# EAGLE design morse_lora_v6 (EAGLE 9.6.2)
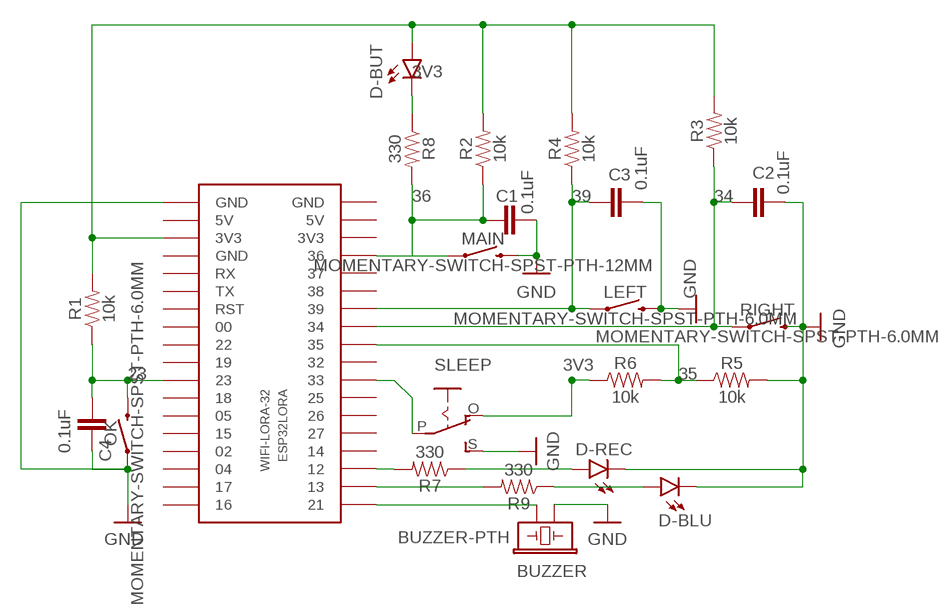
[diagram p0: schematic, sheet 1]

## Parts
BUZZER  BUZZER-PTH  [BUZZER-12MM]
C1  0.1uF  0.1UF-KIT-EZ-50V-20%  [CAP-PTH-SMALL-KIT]
C2  0.1uF  0.1UF-KIT-EZ-50V-20%  [CAP-PTH-SMALL-KIT]
C3  0.1uF  0.1UF-KIT-EZ-50V-20%  [CAP-PTH-SMALL-KIT]
C4  0.1uF  0.1UF-KIT-EZ-50V-20%  [CAP-PTH-SMALL-KIT]
D-BLU  LED5MM  [LED_5MM]
D-BUT  LED5MM  [LED_5MM]
D-REC  LED5MM  [LED_5MM]
ESP32LORA  WIFI-LORA-32  [2.54MM_2X18]
LEFT  MOMENTARY-SWITCH-SPST-PTH-6.0MM  [TACTILE_SWITCH_PTH_6.0MM]
MAIN  MOMENTARY-SWITCH-SPST-PTH-12MM  [TACTILE_SWITCH_PTH_12MM]
OK  MOMENTARY-SWITCH-SPST-PTH-6.0MM  [TACTILE_SWITCH_PTH_6.0MM]
R1  10k  10KOHM-HORIZ_KIT-1/4W-1%  [AXIAL-0.3-KIT]
R2  10k  10KOHM-HORIZ_KIT-1/4W-1%  [AXIAL-0.3-KIT]
R3  10k  10KOHM-HORIZ_KIT-1/4W-1%  [AXIAL-0.3-KIT]
R4  10k  10KOHM-HORIZ_KIT-1/4W-1%  [AXIAL-0.3-KIT]
R5  10k  10KOHM-HORIZ_KIT-1/4W-1%  [AXIAL-0.3-KIT]
R6  10k  10KOHM-HORIZ_KIT-1/4W-1%  [AXIAL-0.3-KIT]
R7  330  330OHM-HORIZ-1/10W-5%  [AXIAL-0.3]
R8  330  330OHM-HORIZ-1/10W-5%  [AXIAL-0.3]
R9  330  330OHM-HORIZ-1/10W-5%  [AXIAL-0.3]
RIGHT  MOMENTARY-SWITCH-SPST-PTH-6.0MM  [TACTILE_SWITCH_PTH_6.0MM]
SLEEP  EG1218S  [EG1218]

## Nets
3V3: D-BUT.A ESP32LORA.P$3(3V3) R1.P$2 R2.P$2 R3.P$2 R4.P$2 R6.P$1 SLEEP.O
23: C4.2 ESP32LORA.P$11 OK.3 R1.P$1
34: C2.2 ESP32LORA.P$29 R3.P$1 RIGHT.1
35: ESP32LORA.P$28 R5.P$1 R6.P$2
36: C1.2 ESP32LORA.P$33 MAIN.1 R2.P$1 R8.P$2
39: C3.1 ESP32LORA.P$30 LEFT.1 R4.P$1
GND: BUZZER.- C1.1 C2.1 C3.2 C4.1 D-BLU.K(C) D-REC.K(C) ESP32LORA.P$1(GND) LEFT.3 MAIN.3 OK.1 R5.P$2 RIGHT.3 SLEEP.S
N$1: ESP32LORA.P$21 R7.P$2
N$2: D-BUT.K(C) R8.P$1
N$3: D-BLU.A R9.P$1
N$4: BUZZER.+ ESP32LORA.P$19
N$5: D-REC.A R7.P$1
N$6: ESP32LORA.P$20 R9.P$2
N$13: ESP32LORA.P$26 SLEEP.P
Unconnected: ESP32LORA.P$2(5V) ESP32LORA.P$4(GND) ESP32LORA.P$5(RX) ESP32LORA.P$6(TX) ESP32LORA.P$7(RST) ESP32LORA.P$8 ESP32LORA.P$9 ESP32LORA.P$10 ESP32LORA.P$12 ESP32LORA.P$13 ESP32LORA.P$14 ESP32LORA.P$15 ESP32LORA.P$16 ESP32LORA.P$17 ESP32LORA.P$18 ESP32LORA.P$22 ESP32LORA.P$23 ESP32LORA.P$24 ESP32LORA.P$25 ESP32LORA.P$27 ESP32LORA.P$31 ESP32LORA.P$32 ESP32LORA.P$34(3V3) ESP32LORA.P$35(5V) ESP32LORA.P$36(GND)

## Library data of the parts
BUZZER = SparkFun-Electromechanical:BUZZER: Buzzer Small round buzzers that operate around the audible 2kHz range. You can use these as speakers to create simple music or user interfaces. Variant Overview: PTH - Mini Speaker - PC Mount 12mm 2.048kHz <https://www.sparkfun.com/products/7950> PTH_KIT - Mini Speaker - PC Mount 12mm 2.048kHz <https://www.sparkfun.com/products/7950> KIT simplifies soldering by adding stop mask to one side of the pads. PTH_NO_SILK - Mini Speaker - PC Mount 12mm 2.048kHz <https://www.sparkfun.com/products/7950> No silkscreen indicator of buzzer outline. PTH_KIT_NO_SILK - Mini Speaker - PC Mount 12mm 2.048kHz <https://www.sparkfun.com/products/7950> KIT package w/o silkscreen SMD - Buzzer Audio Magnetic (CCV-084B16) SMD buzzer used on, e.g. the LilyPad Buzzer <https://www.sparkfun.com/products/8463> and RFID USB Reader <https://www.sparkfun.com/products/9963>. SMD_KIT - Buzzer Audio Magnetic (CCV-084B16) SMD Buzzer with elongated pins to make soldering easier. Used on the SparkFun Simon Says - Surface Mount Soldering Kit <https://www.sparkfun.com/products/10935>.; PROD_ID: COMP-08253; SF_SKU: COM-07950
C1-C4 = SparkFun-Capacitors:0.1UF: 0.1µF ceramic capacitors A capacitor is a passive two-terminal electrical component used to store electrical energy temporarily in an electric field.; PROD_ID: CAP-08370
D-BLU D-BUT D-REC = SparkFun-LED:LED: LED (Generic) Standard schematic elements and footprints for 5mm, 3mm, 1206, and 0603 sized LEDs. Generic LEDs with no color specified.
ESP32LORA = ESP32_modules:WIFI-LORA-32
LEFT OK RIGHT = SparkFun-Switches:MOMENTARY-SWITCH-SPST: Momentary Switch (Pushbutton) - SPST Normally-open (NO) SPST momentary switches (buttons, pushbuttons). Variants PTH-12MM - 12mm square, through-hole Momentary Pushbutton Switch - 12mm Square <https://www.sparkfun.com/products/9190> (COM-09190) PTH-6.0MM, PTH-6.0MM-KIT - 6.0mm square, through-hole Mini Pushbutton Switch <https://www.sparkfun.com/products/97> (COM-00097) KIT package intended for soldering kit's - only one side of pads' copper is exposed. PTH-RIGHT-ANGLE-KIT - Right-angle, through-hole Right Angle Tactile Button <https://www.sparkfun.com/products/10791> - Used on SparkFun BigTime Watch Kit <https://www.sparkfun.com/products/11734> SMD-12MM - 12mm square, surface-mount Tactile Button - SMD (12mm) <https://www.sparkfun.com/products/12993> (COM-12993) Used on SparkFun PicoBoard <https://www.sparkfun.com/products/11888> SMD-4.5MM - 4.5mm Square Trackball Switch Used on SparkFun Blackberry Trackballer Breakout <https://www.sparkfun.com/products/13169> SMD-4.6MMX2.8MM - 4.60mm x 2.80mm, surface mount Used on SparkFun SAMD21 Mini Breakout <https://www.sparkfun.com/products/13664> SMD-5.2MM, SMD-5.2-REDUNDANT - 5.2mm square, surface-mount Mini Pushbutton Switch - SMD <https://www.sparkfun.com/products/8720> (COM-08720) Used on Arduino Pro Mini <https://www.sparkfun.com/products/11114> REDUNDANT package connects both switch circuits together SMD-6.0X3.5MM - 6.0 x 3.5mm, surface mount Momentary Reset Switch SMD <https://www.sparkfun.com/products/8229> (COM-08229) SMD-6.2MM-TALL - 6.2mm square, surface mount Tactile Button - SMD (6mm) <https://www.sparkfun.com/products/12992> Used on SparkFun Digital Sandbox <https://www.sparkfun.com/products/12651> SMD-RIGHT-ANGLE - Right-angle, surface mount Used on SparkFun Block for Intel® Edison - Arduino <https://www.sparkfun.com/products/13036>; PROD_ID: SWCH-08441; SF_SKU: COM-00097
MAIN = SparkFun-Switches:MOMENTARY-SWITCH-SPST: Momentary Switch (Pushbutton) - SPST Normally-open (NO) SPST momentary switches (buttons, pushbuttons). Variants PTH-12MM - 12mm square, through-hole Momentary Pushbutton Switch - 12mm Square <https://www.sparkfun.com/products/9190> (COM-09190) PTH-6.0MM, PTH-6.0MM-KIT - 6.0mm square, through-hole Mini Pushbutton Switch <https://www.sparkfun.com/products/97> (COM-00097) KIT package intended for soldering kit's - only one side of pads' copper is exposed. PTH-RIGHT-ANGLE-KIT - Right-angle, through-hole Right Angle Tactile Button <https://www.sparkfun.com/products/10791> - Used on SparkFun BigTime Watch Kit <https://www.sparkfun.com/products/11734> SMD-12MM - 12mm square, surface-mount Tactile Button - SMD (12mm) <https://www.sparkfun.com/products/12993> (COM-12993) Used on SparkFun PicoBoard <https://www.sparkfun.com/products/11888> SMD-4.5MM - 4.5mm Square Trackball Switch Used on SparkFun Blackberry Trackballer Breakout <https://www.sparkfun.com/products/13169> SMD-4.6MMX2.8MM - 4.60mm x 2.80mm, surface mount Used on SparkFun SAMD21 Mini Breakout <https://www.sparkfun.com/products/13664> SMD-5.2MM, SMD-5.2-REDUNDANT - 5.2mm square, surface-mount Mini Pushbutton Switch - SMD <https://www.sparkfun.com/products/8720> (COM-08720) Used on Arduino Pro Mini <https://www.sparkfun.com/products/11114> REDUNDANT package connects both switch circuits together SMD-6.0X3.5MM - 6.0 x 3.5mm, surface mount Momentary Reset Switch SMD <https://www.sparkfun.com/products/8229> (COM-08229) SMD-6.2MM-TALL - 6.2mm square, surface mount Tactile Button - SMD (6mm) <https://www.sparkfun.com/products/12992> Used on SparkFun Digital Sandbox <https://www.sparkfun.com/products/12651> SMD-RIGHT-ANGLE - Right-angle, surface mount Used on SparkFun Block for Intel® Edison - Arduino <https://www.sparkfun.com/products/13036>; PROD_ID: SWCH-09185; SF_SKU: COM-09190
R1-R6 = SparkFun-Resistors:10KOHM: 10kΩ resistor A resistor is a passive two-terminal electrical component that implements electrical resistance as a circuit element. Resistors act to reduce current flow, and, at the same time, act to lower voltage levels within circuits. - Wikipedia; PROD_ID: RES-12183
R7-R9 = SparkFun-Resistors:330OHM: 330Ω resistor A resistor is a passive two-terminal electrical component that implements electrical resistance as a circuit element. Resistors act to reduce current flow, and, at the same time, act to lower voltage levels within circuits. - Wikipedia; PROD_ID: RES-8371
SLEEP = adafruit:EG1218: SLIDING SWITCH 0.1" spacing through hole, vertical SPDT slide switch http://www.ladyada.net/library/pcb/eaglelibrary.html

## Board
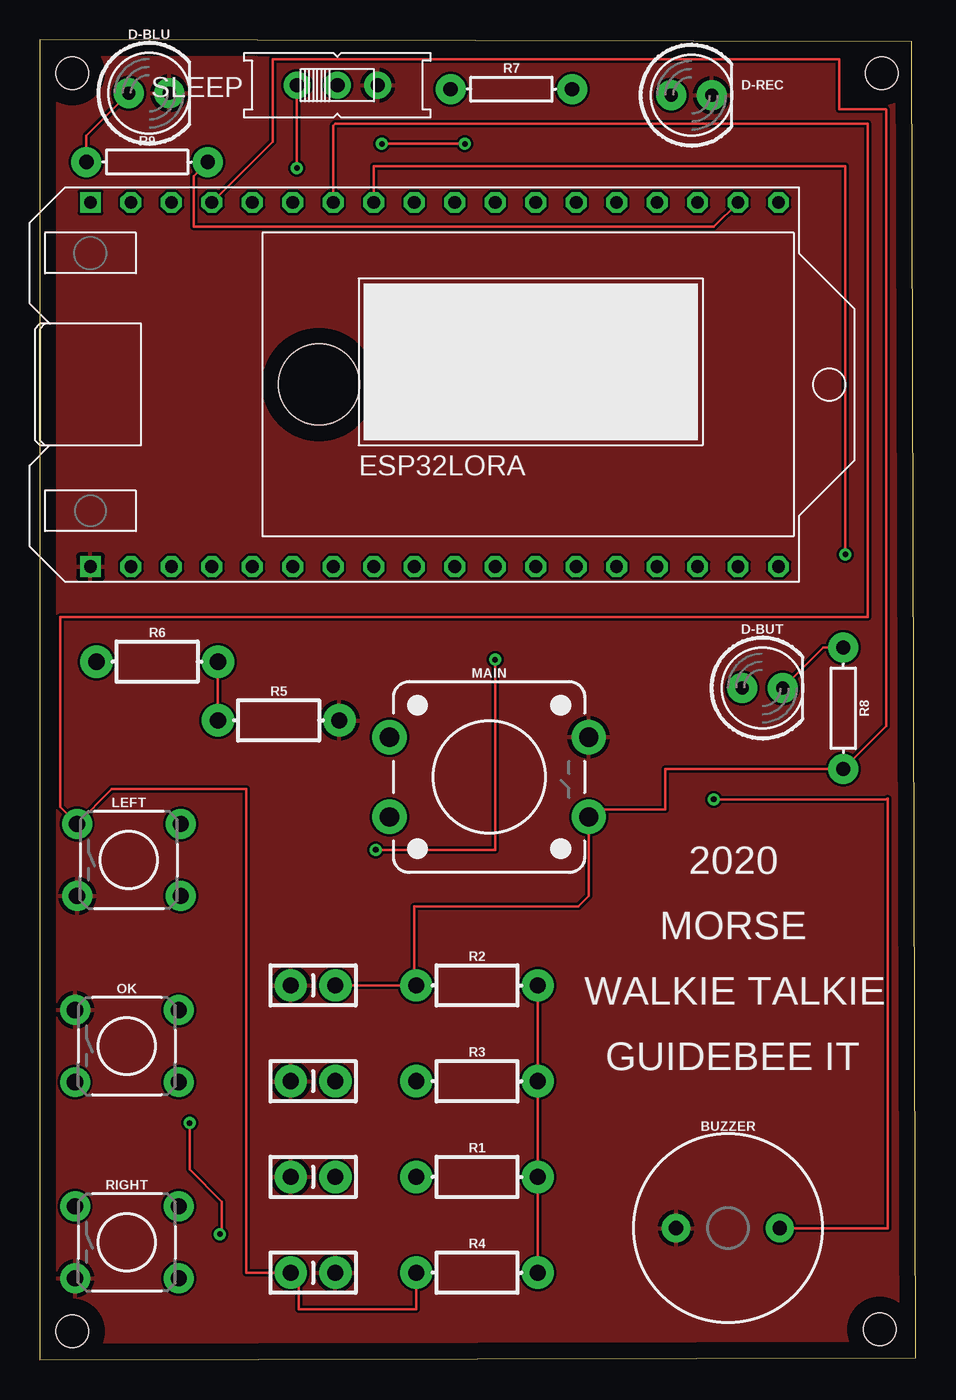
[diagram p1: board, top side]
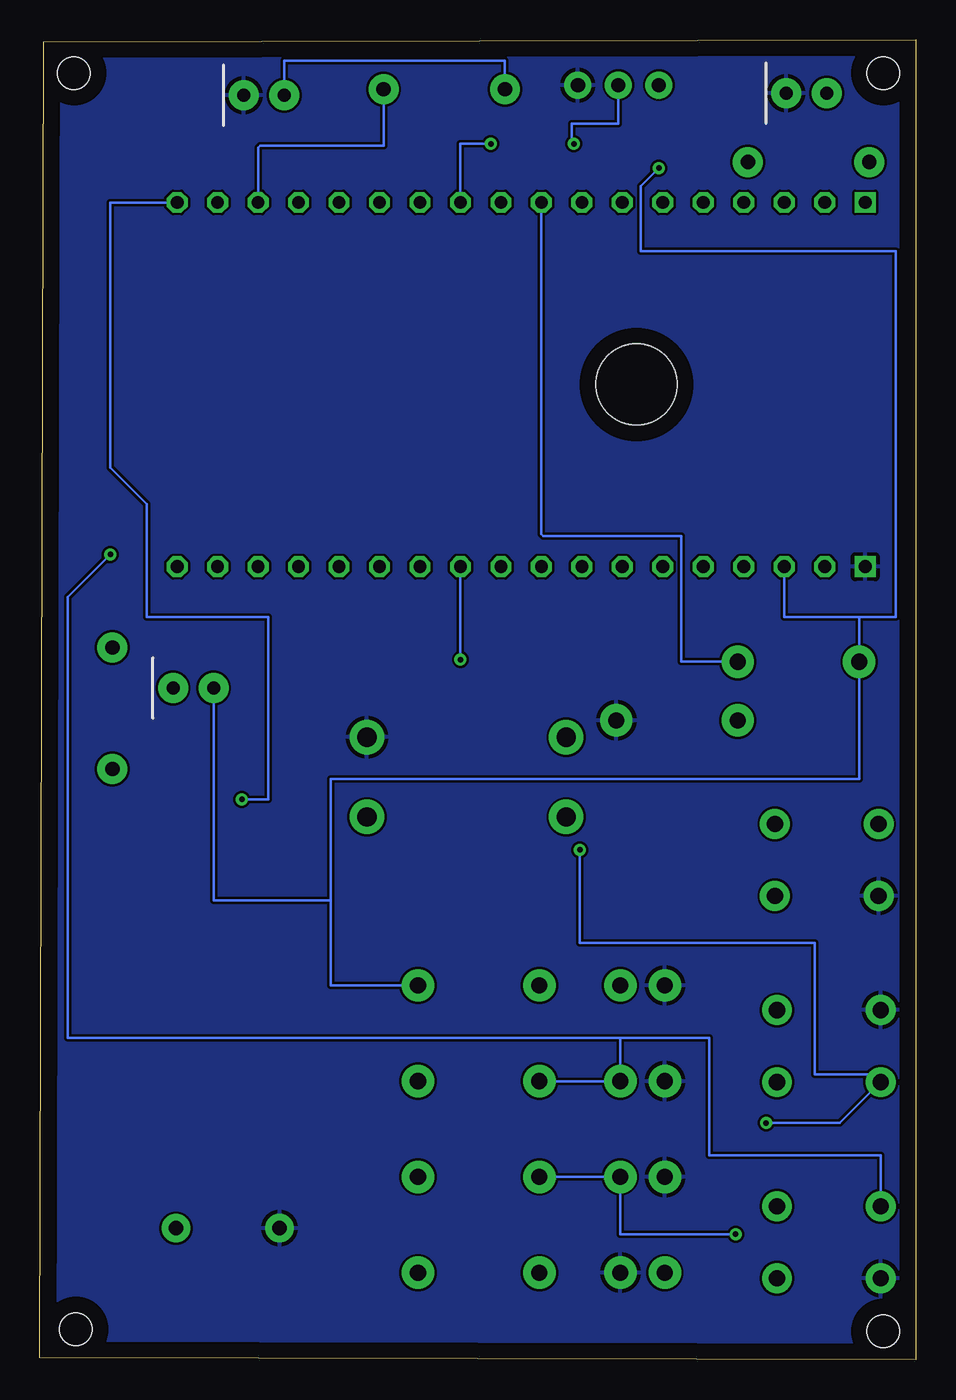
[diagram p2: board, bottom side, seen from below]

Size 54.97 x 82.85 mm. Coordinates in mm from the lower left corner, seen from the top.
Outline: 0,0 54.97,0.13 54.72,82.73 0,82.86 0,0
Copper layers (1*16): Top 0.035mm / dielectric 1.5mm / Bottom 0.035mm
Design rules "default": minimum track width 6mil, minimum drill 0.35mm, track to track 6mil, track to pad 6mil, pad to pad 6mil, via to via 6mil, smd to smd 6mil, copper to edge 40mil, drill to drill 6mil, minimum pad ring 10mil, minimum via ring 8mil, stop-mask expansion 4mil, vias tented up to drill 0mil, thermal gap 10mil
Holes 2.03 mm at 2.03,80.77 52.83,80.77 52.7,1.9 2.03,1.78
Holes 5.08 mm at 17.53,61.21

### Footprints (pad centres in the part's own frame; a part is rotated, then mirrored left to right if it is on the bottom)
BUZZER-12MM = drill 0.9 pad 1.778: + 3.25,0; - -3.25,0
CAP-PTH-SMALL-KIT = drill 1.016 pad 2.032: 1 -1.397,0; 2 1.397,0
LED_5MM = drill 0.813 pad 1.88: A -1.27,0; K 1.27,0
2.54MM_2X18 = drill 0.8 square: P$1 -20.32,-11.43; P$36 -20.32,11.43 | drill 0.8 octagon: P$2 -17.78,-11.43; P$3 -15.24,-11.43; P$4 -12.7,-11.43; P$5 -10.16,-11.43; P$6 -7.62,-11.43; P$7 -5.08,-11.43; P$8 -2.54,-11.43; P$9 0,-11.43; P$10 2.54,-11.43; P$11 5.08,-11.43; P$12 7.62,-11.43; P$13 10.16,-11.43; P$14 12.7,-11.43; P$15 15.24,-11.43; P$16 17.78,-11.43; P$17 20.32,-11.43; P$18 22.86,-11.43; P$19 22.86,11.43; P$20 20.32,11.43; P$21 17.78,11.43; P$22 15.24,11.43; P$23 12.7,11.43; P$24 10.16,11.43; P$25 7.62,11.43; P$26 5.08,11.43; P$27 2.54,11.43; P$28 0,11.43; P$29 -2.54,11.43; P$30 -5.08,11.43; P$31 -7.62,11.43; P$32 -10.16,11.43; P$33 -12.7,11.43; P$34 -15.24,11.43; P$35 -17.78,11.43
TACTILE_SWITCH_PTH_6.0MM = drill 1.016 pad 1.88: 1 -3.251,2.261; 2 3.251,2.261; 3 -3.251,-2.261; 4 3.251,-2.261
TACTILE_SWITCH_PTH_12MM = drill 1.2 pad 2.159: 1 6.25,-2.5; 2 -6.25,-2.5; 3 6.25,2.5; 4 -6.25,2.5
AXIAL-0.3-KIT = drill 1.016 pad 2.032: P$1 -3.81,0; P$2 3.81,0
AXIAL-0.3 = drill 0.9 pad 1.88: P$1 -3.81,0; P$2 3.81,0
EG1218 = drill 0.9 pad 1.676: O -2.54,0; P 0,0; S 2.54,0

### Placement (x,y rotation side)
BUZZER  43.18,8.25 0 top
C1  17.15,23.49 0 top
C2  17.15,17.48 0 top
C3  17.15,5.46 0 top
C4  17.15,11.47 0 top
D-BLU  6.86,79.5 0 top
D-BUT  45.34,42.16 0 top
D-REC  40.89,79.38 0 top
ESP32LORA  23.5,61.21 0 top
LEFT  5.59,31.37 0 top
MAIN  28.19,36.58 0 top
OK  5.46,19.68 0 top
R1  27.43,11.47 0 top
R2  27.43,23.49 0 top
R3  27.43,17.48 0 top
R4  27.43,5.46 0 top
R5  14.99,40.13 0 top
R6  7.37,43.81 0 top
R7  29.59,79.76 0 top
R8  50.42,40.89 270 top
R9  6.73,75.18 0 top
RIGHT  5.46,7.37 0 top
SLEEP  18.67,80.01 0 top

### Tracks (layer width: path | path; a pad name or v marks a point on that pad's centre or on a via)
3V3  (via drill 0.35)
  Top 0.152: SLEEP.O v16.13,74.8 | R2.P$2 R3.P$2 R1.P$2 R4.P$2
  Bottom 0.152: v16.13,74.8 17.27,73.66 17.27,69.6 1.27,69.6 1.27,46.61 3.56,46.61 | 3.56,46.61 8.26,46.61 ESP32LORA.P$3 | 36.7,28.83 36.7,36.45 3.56,36.45 R6.P$1 3.56,46.61 | R2.P$2 36.7,23.49 36.7,28.83 | D-BUT.A 44.07,28.83 36.7,28.83
23  (via drill 0.35)
  Top 0.152: v28.58,43.94 28.58,32 v21.08,32 | v9.4,14.86 9.4,11.94 11.43,9.91 11.43,8 v11.3,7.87
  Bottom 0.152: ESP32LORA.P$11 v28.58,43.94 | v21.08,32 21.08,26.16 6.35,26.16 6.35,17.91 2.69,17.91 OK.3 4.77,14.86 v9.4,14.86 | v11.3,7.87 18.54,7.87 C4.2 R1.P$1
34  (via drill 0.35)
  Top 0.152: ESP32LORA.P$29 20.96,74.93 50.55,74.93 v50.55,50.55
  Bottom 0.152: v50.55,50.55 53.21,47.88 53.21,20.19 18.54,20.19 | 18.54,20.19 C2.2 R3.P$1 | 18.54,20.19 12.95,20.19 12.95,12.83 2.21,12.83 RIGHT.1
35
  Top 0.152: R6.P$2 R5.P$1
  Bottom 0.152: ESP32LORA.P$28 23.5,51.82 23.37,51.69 14.73,51.69 14.73,43.81 R6.P$2
36
  Top 0.152: C1.2 R2.P$1 23.5,23.62 23.5,28.45 33.78,28.45 34.44,29.11 MAIN.1 34.91,34.54 39.24,34.54 39.24,37.08 R8.P$2 53.12,39.78 53.12,78.45 53.09,78.49 50.16,78.49 50.16,81.64 14.61,81.64 14.61,76.45 ESP32LORA.P$33
39
  Top 0.152: ESP32LORA.P$30 18.42,77.47 18.54,77.6 51.94,77.6 51.94,46.61 1.27,46.61 1.27,34.7 LEFT.1 4.52,35.81 12.95,35.81 12.95,5.46 C3.1 16.26,4.95 16.26,3.17 23.62,3.17 R4.P$1
GND
  pour Top: 54.48,-0.25 54.48,82.55 0.38,82.55 0.38,0.38 53.85,0.38
  pour Bottom: 54.36,0.38 0.38,0.38 0.38,82.55 54.36,82.55
N$1
  Bottom 0.152: R7.P$2 33.4,76.2 41.15,76.2 41.27,76.07 ESP32LORA.P$21
N$2
  Top 0.152: D-BUT.K 49.15,44.7 R8.P$1
N$3
  Top 0.152: R9.P$1 2.92,76.83 D-BLU.A
N$4  (via drill 0.35)
  Top 0.152: v42.29,35.18 53.06,35.18 53.21,35.22 53.21,8.25 BUZZER.+
  Bottom 0.152: ESP32LORA.P$19 50.55,72.64 50.55,56.01 48.26,53.72 48.26,46.61 40.64,46.61 40.64,35.18 v42.29,35.18
N$5
  Bottom 0.152: R7.P$1 25.78,81.53 39.62,81.53 D-REC.A
N$6
  Top 0.152: ESP32LORA.P$20 42.29,71.12 9.65,71.12 9.65,74.3 R9.P$2
N$13  (via drill 0.35)
  Top 0.152: v26.67,76.33 v21.46,76.33
  Bottom 0.152: ESP32LORA.P$26 28.58,76.33 v26.67,76.33 | v21.46,76.33 21.59,76.45 21.59,77.6 18.67,77.6 SLEEP.P

### Text on the board
tNames: 2020 | MORSE | WALKIE TALKIE | GUIDEBEE IT